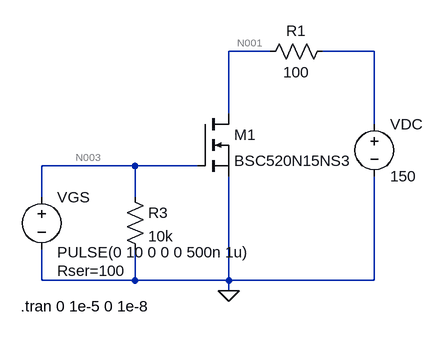
[diagram p0: schematic switching waveform.asc]
switching waveform.asc, the LTspice schematic file:
Version 4
SHEET 1 880 680
WIRE 240 0 176 0
WIRE 400 0 320 0
WIRE 176 96 176 0
WIRE 400 112 400 0
WIRE 32 176 -112 176
WIRE 128 176 32 176
WIRE -112 224 -112 176
WIRE 32 224 32 176
WIRE -112 352 -112 304
WIRE 32 352 32 304
WIRE 32 352 -112 352
WIRE 176 352 176 192
WIRE 176 352 32 352
WIRE 400 352 400 192
WIRE 400 352 176 352
WIRE 176 368 176 352
FLAG 176 368 0
SYMBOL nmos 128 96 R0
SYMATTR InstName M1
SYMATTR Value BSC520N15NS3
SYMBOL voltage -112 208 R0
WINDOW 3 24 101 Left 2
WINDOW 123 0 0 Left 2
WINDOW 39 24 129 Left 2
SYMATTR InstName VGS
SYMATTR Value PULSE(0 10 0 0 0 500n 1u)
SYMATTR SpiceLine Rser=100
SYMBOL voltage 400 96 R0
WINDOW 123 0 0 Left 2
WINDOW 39 0 0 Left 2
SYMATTR InstName VDC
SYMATTR Value 150
SYMBOL res 16 208 R0
SYMATTR InstName R3
SYMATTR Value 10k
SYMBOL res 336 -16 R90
WINDOW 0 0 56 VBottom 2
WINDOW 3 32 56 VTop 2
SYMATTR InstName R1
SYMATTR Value 100
TEXT -144 392 Left 2 !.tran 0 1e-5 0 1e-8

The netlist it stands for:
* switching waveform.asc
M1 N001 N003 0 0 BSC520N15NS3
VGS N003 0 PULSE(0 10 0 0 0 500n 1u) Rser=100
VDC N002 0 150
R3 N003 0 10k
R1 N002 N001 100
.model NMOS NMOS
.model PMOS PMOS
.lib standard.mos
.tran 0 1e-5 0 1e-8
.backanno
.end

* Results of the author's LTspice run, read from the files saved beside the schematic
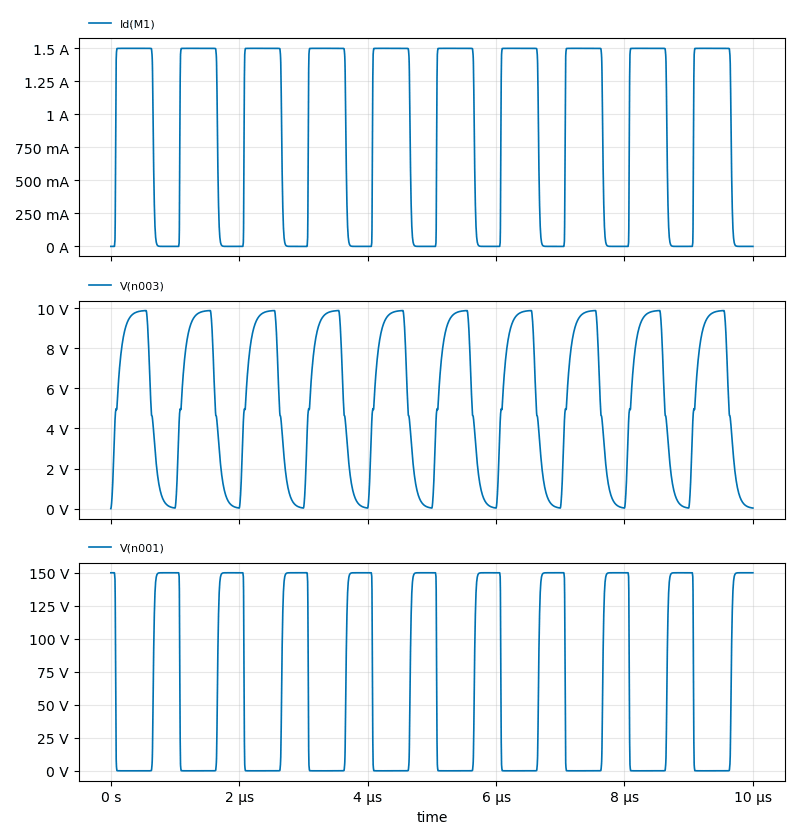
[diagram p1: Transient Analysis of switching waveform.asc, plotted from the saved traces]
* Transient Analysis, 1 run:
*   Id(M1): min -217.6 µA, max 1.499 A, average 887.2 mA, rms 1.142 A, last 1.315 µA
*   V(n003): min 0 V, max 9.888 V, average 5.445 V, rms 6.74 V, last 28.28 mV
*   V(n001): min 64.68 mV, max 150 V, average 61.28 V, rms 94.41 V, last 150 V